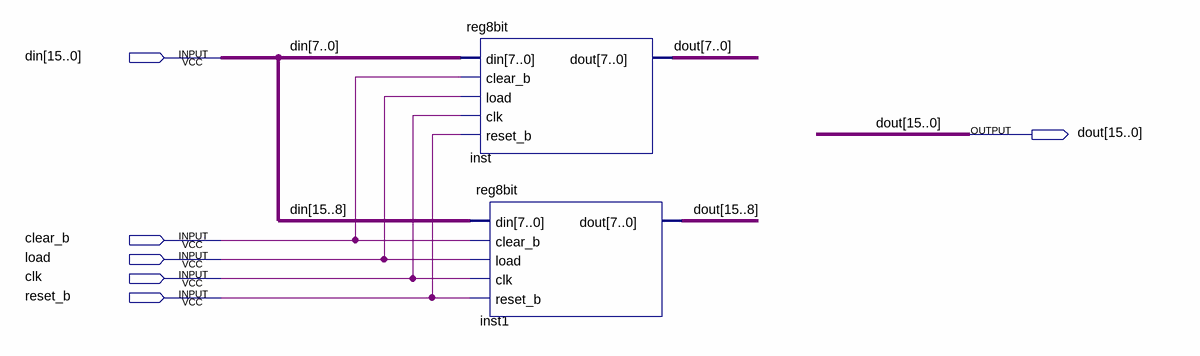
[diagram p0: schematic sheet]
// Quartus schematic reg16bit.bdf as structural Verilog: 2 symbols, 6 pins
module reg16bit (
  input  [15:0] din,
  input  clear_b,
  input  load,
  input  clk,
  input  reset_b,
  output [15:0] dout
);

  reg8bit inst (.din(din[7:0]), .clear_b(clear_b), .load(load), .clk(clk), .reset_b(reset_b), .dout(dout[7:0]));
  reg8bit inst1 (.din(din[15:8]), .clear_b(clear_b), .load(load), .clk(clk), .reset_b(reset_b), .dout(dout[15:8]));
endmodule
